# EAGLE design vu3 (EAGLE 6.2)
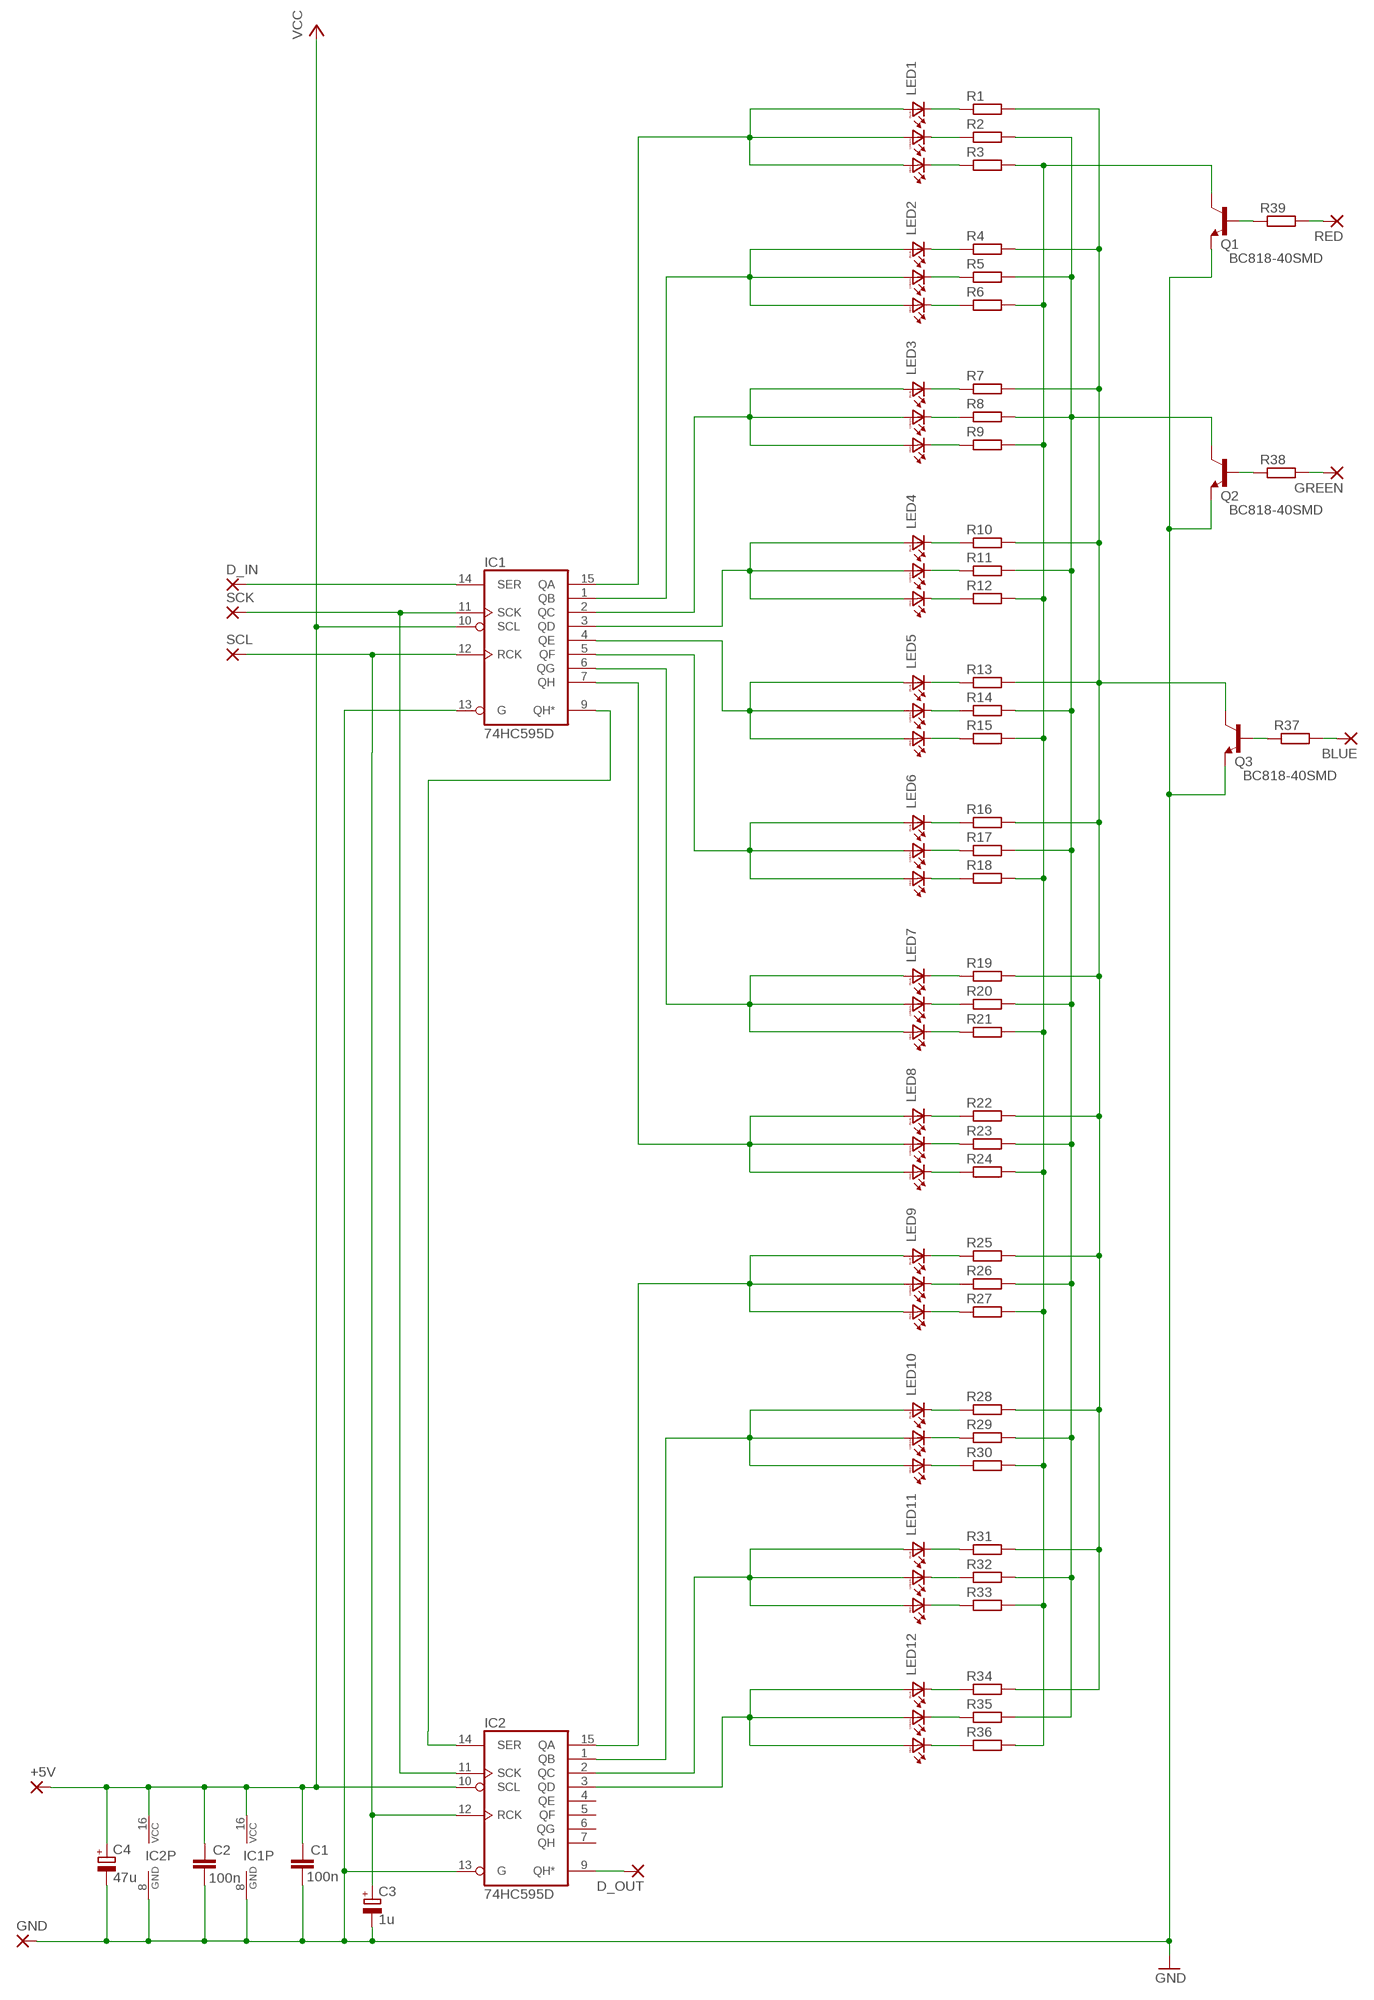
[diagram p0: schematic, sheet 1]

## Parts
+5V  2,54/0,8  [2,54/0,8]
BLUE  2,54/0,8  [2,54/0,8]
C1  100n  C-EUC1206  [C1206]
C2  100n  C-EUC1206  [C1206]
C3  1u  CPOL-EUE5-5-L-12SMD  [E5-5-L-12SMD]
C4  47u  CPOL-EUE2.5-5-L-12-SMD  [E2,5-5-L-12SMD]
D_IN  2,54/0,8  [2,54/0,8]
D_OUT  2,54/0,8  [2,54/0,8]
GND  2,54/0,8  [2,54/0,8]
GREEN  2,54/0,8  [2,54/0,8]
IC1  74HC595D  [SO16]
IC2  74HC595D  [SO16]
LED1  LED_RGB_PLCC6  [PLCC6]
LED2  LED_RGB_PLCC6  [PLCC6]
LED3  LED_RGB_PLCC6  [PLCC6]
LED4  LED_RGB_PLCC6  [PLCC6]
LED5  LED_RGB_PLCC6  [PLCC6]
LED6  LED_RGB_PLCC6  [PLCC6]
LED7  LED_RGB_PLCC6  [PLCC6]
LED8  LED_RGB_PLCC6  [PLCC6]
LED9  LED_RGB_PLCC6  [PLCC6]
LED10  LED_RGB_PLCC6  [PLCC6]
LED11  LED_RGB_PLCC6  [PLCC6]
LED12  LED_RGB_PLCC6  [PLCC6]
Q1  BC818-40SMD  [SOT23-BEC]
Q2  BC818-40SMD  [SOT23-BEC]
Q3  BC818-40SMD  [SOT23-BEC]
R1  R-EU_R1206  [R1206]
R2  R-EU_R1206  [R1206]
R3  R-EU_R1206  [R1206]
R4  R-EU_R1206  [R1206]
R5  R-EU_R1206  [R1206]
R6  R-EU_R1206  [R1206]
R7  R-EU_R1206  [R1206]
R8  R-EU_R1206  [R1206]
R9  R-EU_R1206  [R1206]
R10  R-EU_R1206  [R1206]
R11  R-EU_R1206  [R1206]
R12  R-EU_R1206  [R1206]
R13  R-EU_R1206  [R1206]
R14  R-EU_R1206  [R1206]
R15  R-EU_R1206  [R1206]
R16  R-EU_R1206  [R1206]
R17  R-EU_R1206  [R1206]
R18  R-EU_R1206  [R1206]
R19  R-EU_R1206  [R1206]
R20  R-EU_R1206  [R1206]
R21  R-EU_R1206  [R1206]
R22  R-EU_R1206  [R1206]
R23  R-EU_R1206  [R1206]
R24  R-EU_R1206  [R1206]
R25  R-EU_R1206  [R1206]
R26  R-EU_R1206  [R1206]
R27  R-EU_R1206  [R1206]
R28  R-EU_R1206  [R1206]
R29  R-EU_R1206  [R1206]
R30  R-EU_R1206  [R1206]
R31  R-EU_R1206  [R1206]
R32  R-EU_R1206  [R1206]
R33  R-EU_R1206  [R1206]
R34  R-EU_R1206  [R1206]
R35  R-EU_R1206  [R1206]
R36  R-EU_R1206  [R1206]
R37  R-EU_R1206  [R1206]
R38  R-EU_R1206  [R1206]
R39  R-EU_R1206  [R1206]
RED  2,54/0,8  [2,54/0,8]
SCK  2,54/0,8  [2,54/0,8]
SCL  2,54/0,8  [2,54/0,8]

## Nets
N$1: LED1.BC R1.1
N$2: R39.2 RED.1(P)
N$3: LED1.RC R3.1
N$5: LED2.GC R5.1
N$6: IC1.11(SCK) IC2.11(SCK) SCK.1(P)
N$7: LED3.BC R7.1
N$9: LED3.RC R9.1
N$10: +5V.1(P) C1.1 C2.1 C4.+ IC1.10(SCL) IC1.16(VCC) IC2.10(SCL) IC2.16(VCC) ; supply symbol labelled VCC
N$11: LED4.GC R11.1
N$12: IC2.15(QA) LED9.BA LED9.GA LED9.RA
N$13: LED5.BC R13.1
N$14: LED1.GC R2.1
N$15: LED5.RC R15.1
N$16: LED2.BC R4.1
N$17: LED6.GC R17.1
N$18: LED2.RC R6.1
N$19: LED7.BC R19.1
N$20: LED3.GC R8.1
N$21: LED7.RC R21.1
N$22: LED4.BC R10.1
N$23: LED8.GC R23.1
N$24: LED4.RC R12.1
N$25: LED9.BC R25.1
N$26: LED5.GC R14.1
N$27: LED9.RC R27.1
N$28: LED6.BC R16.1
N$29: LED10.GC R29.1
N$30: LED6.RC R18.1
N$31: LED11.BC R31.1
N$32: LED7.GC R20.1
N$33: LED11.RC R33.1
N$34: LED8.BC R22.1
N$35: LED12.GC R35.1
N$36: LED8.RC R24.1
N$38: LED9.GC R26.1
N$40: LED10.BC R28.1
N$42: LED10.RC R30.1
N$44: LED11.GC R32.1
N$45: LED12.BC R34.1
N$46: LED12.RC R36.1
N$51: GREEN.1(P) R38.2
N$52: IC1.9(QH*) IC2.14(SER)
N$53: Q3.B R37.1
N$54: BLUE.1(P) R37.2
N$55: Q2.B R38.1
N$58: IC1.1(QB) LED2.BA LED2.GA LED2.RA
N$59: IC1.2(QC) LED3.BA LED3.GA LED3.RA
N$60: IC1.3(QD) LED4.BA LED4.GA LED4.RA
N$61: IC1.4(QE) LED5.BA LED5.GA LED5.RA
N$62: IC1.5(QF) LED6.BA LED6.GA LED6.RA
N$63: IC1.6(QG) LED7.BA LED7.GA LED7.RA
N$64: C1.2 C2.2 C3.- C4.- GND.1(P) IC1.8(GND) IC1.13(G) IC2.8(GND) IC2.13(G) Q1.E Q2.E Q3.E ; supply symbol labelled GND
N$68: D_IN.1(P) IC1.14(SER)
N$69: IC1.7(QH) LED8.BA LED8.GA LED8.RA
N$71: Q1.B R39.1
N$72: Q3.C R1.2 R4.2 R7.2 R10.2 R13.2 R16.2 R19.2 R22.2 R25.2 R28.2 R31.2 R34.2
N$78: IC1.15(QA) LED1.BA LED1.GA LED1.RA
N$89: Q2.C R2.2 R5.2 R8.2 R11.2 R14.2 R17.2 R20.2 R23.2 R26.2 R29.2 R32.2 R35.2
N$90: C3.+ IC1.12(RCK) IC2.12(RCK) SCL.1(P)
N$92: D_OUT.1(P) IC2.9(QH*)
N$93: Q1.C R3.2 R6.2 R9.2 R12.2 R15.2 R18.2 R21.2 R24.2 R27.2 R30.2 R33.2 R36.2
N$94: IC2.1(QB) LED10.BA LED10.GA LED10.RA
N$95: IC2.2(QC) LED11.BA LED11.GA LED11.RA
N$96: IC2.3(QD) LED12.BA LED12.GA LED12.RA
Unconnected: IC2.4(QE) IC2.5(QF) IC2.6(QG) IC2.7(QH)

## Library data of the parts
+5V BLUE D_IN D_OUT GND GREEN RED SCK SCL = wirepad:2,54/0,8: THROUGH-HOLE PAD
C1 C2 = resistor:C-EU: CAPACITOR, European symbol
C3 C4 = elkos:CPOL-EU: POLARIZED CAPACITOR, European symbol
IC1 IC2 = 74xx:74*595: 8-bit SHIFT REGISTER, output latch
LED1-LED12 = led-rgb-plcc6:LED_RGB_PLCC6: Full color Z-Power LED RGB P5-II Series Source: http://www.seoulsemicon.co.kr .. F50360.pdf
Q1-Q3 = transistor-npn:BC818*: NPN Transistor
R1-R39 = resistor:R-EU_: RESISTOR, European symbol

## Board
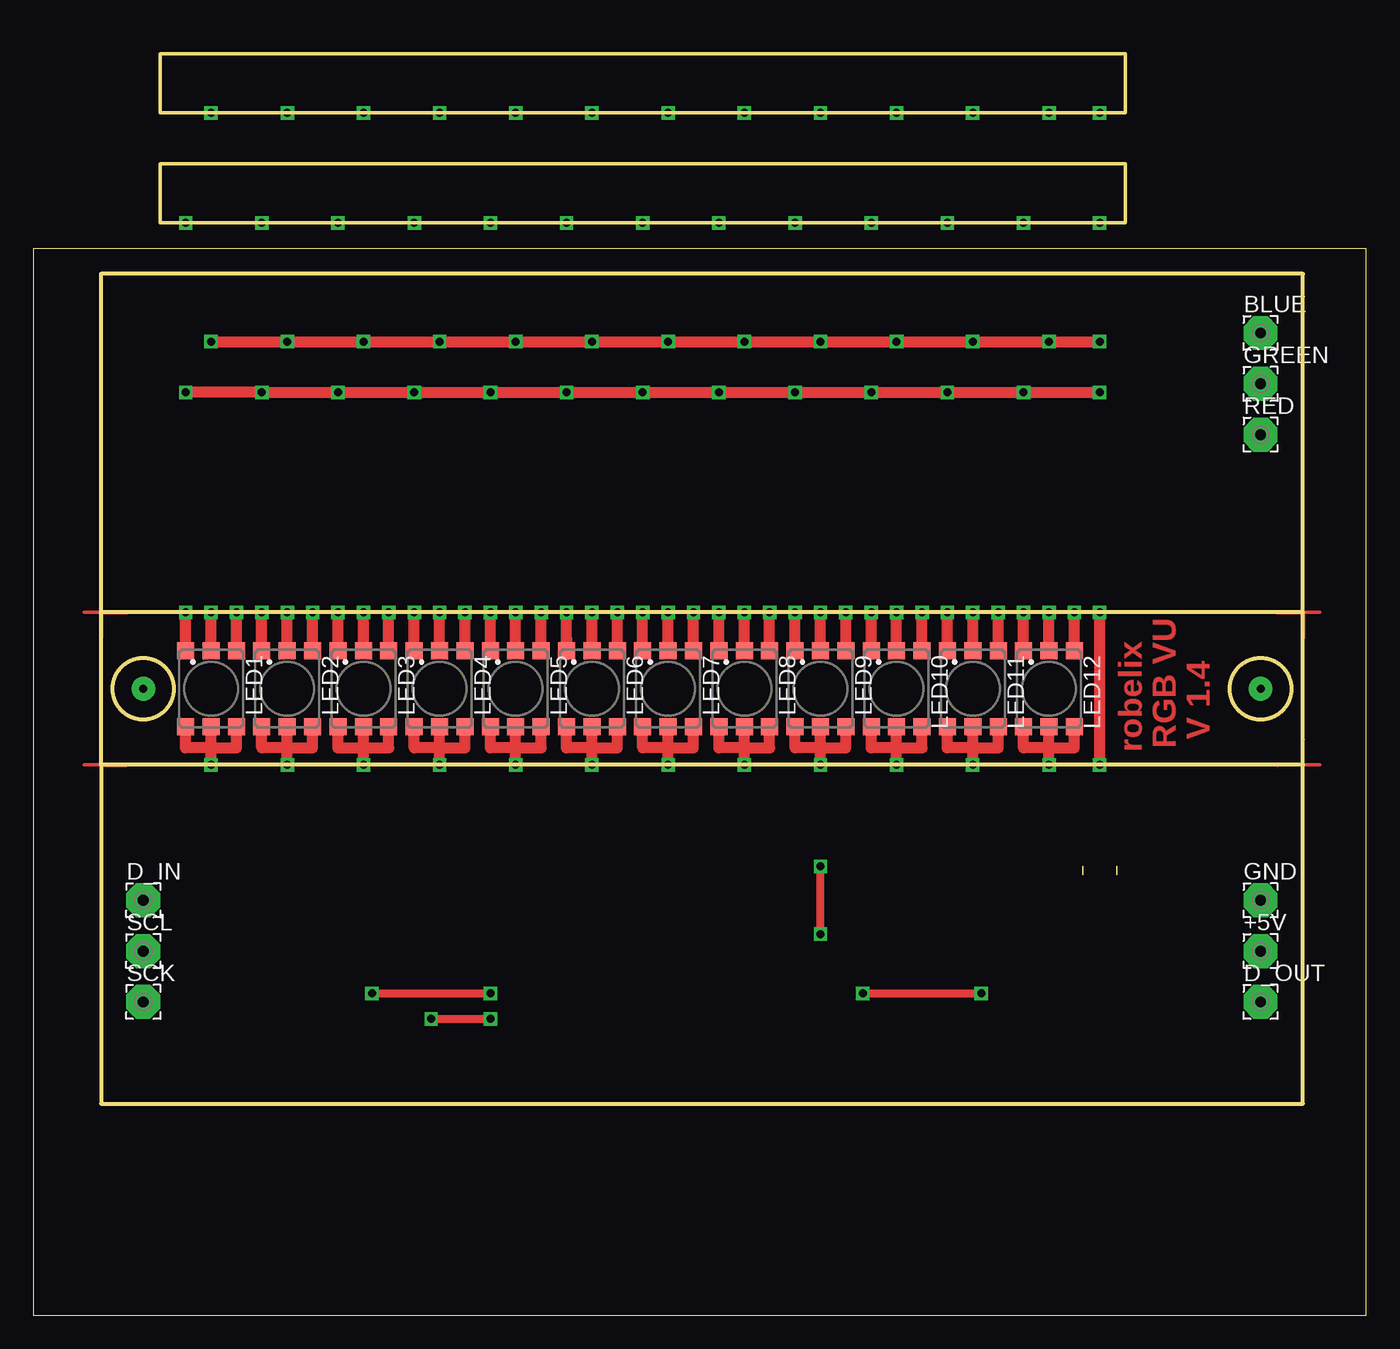
[diagram p1: board, top side]
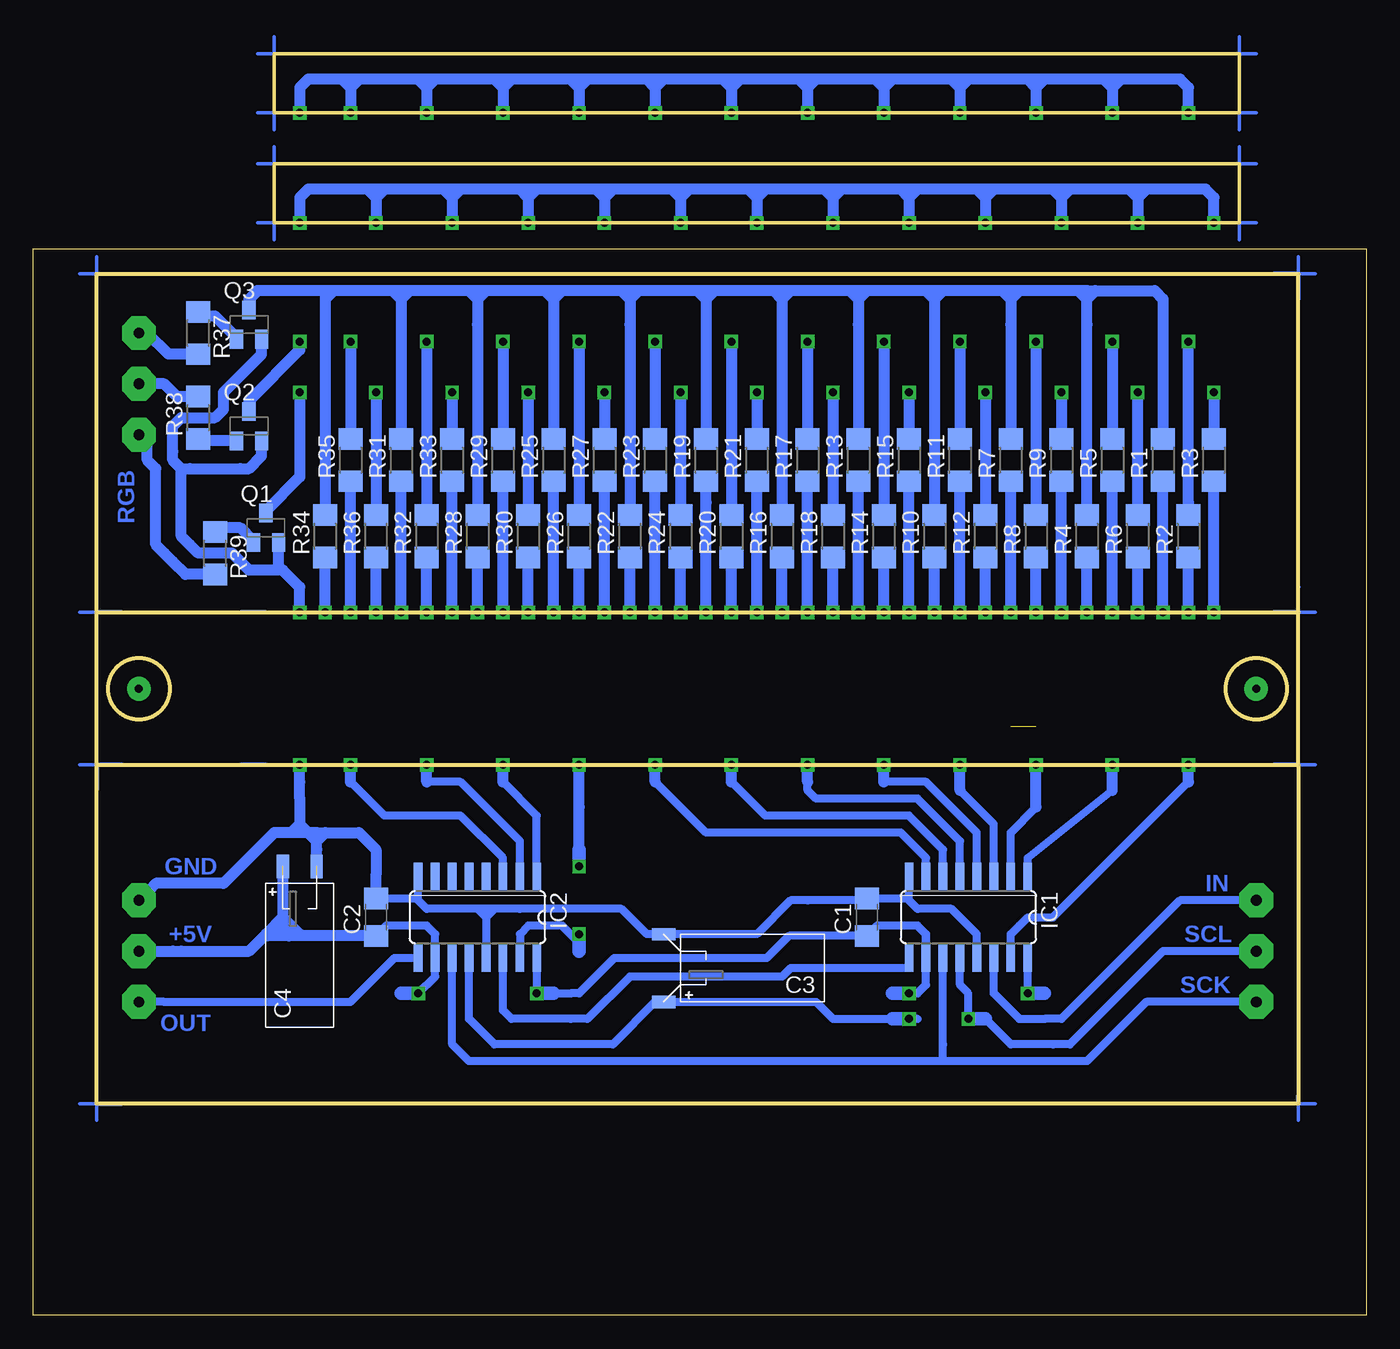
[diagram p2: board, bottom side, seen from below]

Size 100 x 94.61 mm. Coordinates in mm from the lower left corner, seen from the top.
Outline: 95.25,41.27 95.25,15.88 5.08,15.88 5.08,41.27
Outline: 95.25,41.27 95.25,52.7
Outline: 95.25,52.7 95.25,78.11 5.08,78.11 5.08,52.7
Outline: 95.25,41.27 5.08,41.27
Outline: 5.08,41.27 5.08,52.7
Outline: 95.25,52.7 5.08,52.7
Outline: 0,0 100,0 100,80 0,80 0,0
Outline: 9.53,86.36 9.53,81.92 81.92,81.92 81.92,86.36 9.53,86.36
Outline: 9.53,94.61 9.53,90.17 81.92,90.17 81.92,94.61 9.53,94.61
Outline: circle at 8.26,46.99 radius 2.29
Outline: circle at 92.08,46.99 radius 2.29
Copper layers (1*16): Top 0.035mm / dielectric 1.5mm / Bottom 0.035mm
Design rules "default": minimum track width 10mil, minimum drill 24mil, track to track 8mil, track to pad 8mil, pad to pad 8mil, via to via 8mil, smd to smd 8mil, copper to edge 40mil, drill to drill 8mil, minimum pad ring 10mil, minimum via ring 8mil, stop-mask expansion 4mil, vias tented up to drill 0mil, thermal gap 10mil

### Footprints (pad centres in the part's own frame; a part is rotated, then mirrored left to right if it is on the bottom)
2,54/0,8 = drill 0.813 pad 2.54 octagon: 1 0,0
C1206 = smd 1.6 x 1.8: 1 -1.4,0; 2 1.4,0
E5-5-L-12SMD = smd 0.914 x 1.778: + -2.54,0.635; - 2.54,0.635
E2,5-5-L-12SMD = smd 0.914 x 1.778: + -1.27,0.635; - 1.27,0.635
SO16 = smd 0.66 x 2.032: 1 -4.445,-3.073; 2 -3.175,-3.073; 3 -1.905,-3.073; 4 -0.635,-3.073; 5 0.635,-3.073; 6 1.905,-3.073; 7 3.175,-3.073; 8 4.445,-3.073; 9 4.445,3.073; 10 3.175,3.073; 11 1.905,3.073; 12 0.635,3.073; 13 -0.635,3.073; 14 -1.905,3.073; 15 -3.175,3.073; 16 -4.445,3.073
PLCC6 = smd 1.27 x 1.27: BA 2.857,1.905; BC -2.857,1.905; GA 2.857,0; GC -2.857,0; RA 2.857,-1.905; RC -2.857,-1.905
SOT23-BEC = smd 1 x 1.4: B -0.95,-1.1; C 0,1.1; E 0.95,-1.1
R1206 = smd 1.6 x 1.803: 1 -1.587,0; 2 1.587,0

### Placement (x,y rotation side)
+5V  92.08,27.3 0 top
BLUE  92.08,73.66 0 top
C1  37.47,29.84 90 bottom
C2  74.3,29.84 90 bottom
C3  52.07,26.04 90 bottom
C4  80.01,33.02 0 bottom
D_IN  8.26,31.11 0 top
D_OUT  92.08,23.5 0 top
GND  92.08,31.11 0 top
GREEN  92.08,69.85 0 top
IC1  29.84,29.84 180 bottom
IC2  66.67,29.84 180 bottom
LED1  13.34,46.99 270 top
LED2  19.05,46.99 270 top
LED3  24.77,46.99 270 top
LED4  30.48,46.99 270 top
LED5  36.2,46.99 270 top
LED6  41.91,46.99 270 top
LED7  47.62,46.99 270 top
LED8  53.34,46.99 270 top
LED9  59.05,46.99 270 top
LED10  64.77,46.99 270 top
LED11  70.48,46.99 270 top
LED12  76.2,46.99 270 top
Q1  82.55,59.05 0 bottom
Q2  83.82,66.67 0 bottom
Q3  83.82,74.3 0 bottom
R1  15.24,64.14 90 bottom
R2  13.34,58.42 90 bottom
R3  11.43,64.14 90 bottom
R4  20.95,58.42 90 bottom
R5  19.05,64.14 90 bottom
R6  17.14,58.42 90 bottom
R7  26.67,64.14 90 bottom
R8  24.77,58.42 90 bottom
R9  22.86,64.14 90 bottom
R10  32.38,58.42 90 bottom
R11  30.48,64.14 90 bottom
R12  28.57,58.42 90 bottom
R13  38.1,64.14 90 bottom
R14  36.2,58.42 90 bottom
R15  34.29,64.14 90 bottom
R16  43.81,58.42 90 bottom
R17  41.91,64.14 90 bottom
R18  40.01,58.42 90 bottom
R19  49.53,64.14 90 bottom
R20  47.62,58.42 90 bottom
R21  45.72,64.14 90 bottom
R22  55.24,58.42 90 bottom
R23  53.34,64.14 90 bottom
R24  51.44,58.42 90 bottom
R25  60.96,64.14 90 bottom
R26  59.05,58.42 90 bottom
R27  57.15,64.14 90 bottom
R28  66.67,58.42 90 bottom
R29  64.77,64.14 90 bottom
R30  62.87,58.42 90 bottom
R31  72.39,64.14 90 bottom
R32  70.48,58.42 90 bottom
R33  68.58,64.14 90 bottom
R34  78.11,58.42 90 bottom
R35  76.2,64.14 90 bottom
R36  74.3,58.42 90 bottom
R37  87.63,73.66 270 bottom
R38  87.63,67.31 90 bottom
R39  86.36,57.15 270 bottom
RED  92.08,66.04 0 top
SCK  8.26,23.5 0 top
SCL  8.26,27.3 0 top

### Tracks (layer width: path | path; a pad name or v marks a point on that pad's centre or on a via)
N$1  (via drill 0.6 pad 0.25)
  Top 0.813: LED1.BC v15.24,52.7
  Bottom 0.813: v15.24,52.7 R1.1
N$2
  Bottom 0.813: R39.2 88.58,55.56 89.53,56.52 90.17,57.15 90.81,57.78 90.81,63.5 91.44,64.14 91.44,65.41 RED.1
N$3  (via drill 0.6 pad 0.25)
  Top 0.813: LED1.RC v11.43,52.7
  Bottom 0.813: v11.43,52.7 R3.1
N$4  (via drill 0.6 pad 1.78)
  other vias: 92.08,46.99
N$5  (via drill 0.6 pad 0.25)
  Top 0.813: LED2.GC v19.05,52.7
  Bottom 0.813: v19.05,52.7 R5.1
N$6
  Bottom 0.61: SCK.1 16.51,23.5 20.95,19.05 22.23,19.05 30.48,19.05 31.75,19.05 | IC1.11 31.75,20.32 31.75,19.05 | 31.75,19.05 50.16,19.05 67.31,19.05 68.58,20.32 IC2.11
N$7  (via drill 0.6 pad 0.25)
  Top 0.813: LED3.BC v26.67,52.7
  Bottom 0.813: v26.67,52.7 R7.1
N$8  (via drill 0.6 pad 1.78)
  other vias: 8.26,46.99
N$9  (via drill 0.6 pad 0.25)
  Top 0.813: LED3.RC v22.86,52.7
  Bottom 0.813: v22.86,52.7 R9.1
N$10  (via drill 0.6)
  Top 0.61: v25.4,24.13 v34.29,24.13 | v62.23,24.13 v71.12,24.13
  Bottom 0.61: v34.29,24.13 33.66,24.13 33.02,24.77 33.02,28.57 | 33.02,28.57 IC1.10 33.02,28.57 | 33.02,28.57 33.66,29.21 36.7,29.21 C1.1 43.31,28.45 43.81,27.94 44.98,26.77 53.87,26.77 56.41,26.77 59.05,24.13 59.69,24.13 60.96,24.13 | 25.4,25.4 v25.4,24.13 25.4,25.4 | 25.4,25.4 IC1.16 | 25.4,25.4 IC1.16 | 25.4,25.4 IC1.16 | IC2.16 62.23,26.04 62.23,25.4 62.23,24.77 v62.23,24.13 | v71.12,24.13 69.85,25.4 IC2.10 69.85,28.57 70.48,29.21 73.53,29.21 C2.1
  Bottom 0.813: 91.44,27.3 +5V.1 89.53,27.3 88.9,27.3 83.82,27.3 82.55,28.57 | C2.1 80.84,28.45 82.42,28.45 82.55,28.57 | C4.+ 81.28,29.84 | 81.28,29.84 82.55,28.57 | 81.28,29.84 80.01,28.57 80.64,28.57 81.28,29.21 81.92,28.57
  Bottom 1.016: v71.12,24.13 72.39,24.13 | v62.23,24.13 60.96,24.13 | v34.29,24.13 35.56,24.13 | v25.4,24.13 24.13,24.13
N$11  (via drill 0.6 pad 0.25)
  Top 0.813: LED4.GC v30.48,52.7
  Bottom 0.813: v30.48,52.7 R11.1
N$12  (via drill 0.6)
  Top 0.61: v59.05,28.57 v59.05,33.66
  Top 0.813: LED9.RA 57.15,42.55 59.05,42.55 | 59.05,42.55 60.96,42.55 LED9.BA | 59.05,42.55 LED9.GA | v59.05,41.27 59.05,42.55
  Bottom 0.61: IC2.15 63.5,28.57 62.87,29.21 60.33,29.21 59.69,28.57 | v59.05,28.57 59.69,28.57 | 59.69,28.57 59.05,27.94
  Bottom 0.813: v59.05,41.27 59.05,38.1 59.05,34.92 v59.05,33.66
  Bottom 1.016: v59.05,33.66 59.05,34.92 | v59.05,28.57 59.05,27.94 59.05,27.3
N$13  (via drill 0.6 pad 0.25)
  Top 0.813: LED5.BC v38.1,52.7
  Bottom 0.813: v38.1,52.7 R13.1
N$14  (via drill 0.6)
  Top 0.813: LED1.GC v13.34,52.7
  Bottom 0.813: v13.34,52.7 R2.1
N$15  (via drill 0.6 pad 0.25)
  Top 0.813: LED5.RC v34.29,52.7
  Bottom 0.813: v34.29,52.7 R15.1
N$16  (via drill 0.6)
  Top 0.813: LED2.BC v20.95,52.7
  Bottom 0.813: v20.95,52.7 20.95,56.52 R4.1
N$17  (via drill 0.6 pad 0.25)
  Top 0.813: LED6.GC v41.91,52.7
  Bottom 0.813: v41.91,52.7 R17.1
N$18  (via drill 0.6)
  Top 0.813: LED2.RC v17.14,52.7
  Bottom 0.813: v17.14,52.7 R6.1
N$19  (via drill 0.6 pad 0.25)
  Top 0.813: LED7.BC v49.53,52.7
  Bottom 0.813: v49.53,52.7 49.53,60.96 R19.1
N$20  (via drill 0.6)
  Top 0.813: LED3.GC v24.77,52.7
  Bottom 0.813: v24.77,52.7 R8.1
N$21  (via drill 0.6 pad 0.25)
  Top 0.813: LED7.RC v45.72,52.7
  Bottom 0.813: v45.72,52.7 R21.1
N$22  (via drill 0.6)
  Top 0.813: LED4.BC v32.38,52.7
  Bottom 0.813: v32.38,52.7 R10.1
N$23  (via drill 0.6 pad 0.25)
  Top 0.813: LED8.GC v53.34,52.7
  Bottom 0.813: v53.34,52.7 R23.1
N$24  (via drill 0.6)
  Top 0.813: LED4.RC v28.57,52.7
  Bottom 0.813: v28.57,52.7 R12.1
N$25  (via drill 0.6 pad 0.25)
  Top 0.813: LED9.BC v60.96,52.7
  Bottom 0.813: v60.96,52.7 R25.1
N$26  (via drill 0.6)
  Top 0.813: LED5.GC v36.2,52.7
  Bottom 0.813: v36.2,52.7 R14.1
N$27  (via drill 0.6 pad 0.25)
  Top 0.813: LED9.RC v57.15,52.7
  Bottom 0.813: v57.15,52.7 R27.1
N$28  (via drill 0.6)
  Top 0.813: LED6.BC v43.81,52.7
  Bottom 0.813: v43.81,52.7 R16.1
N$29  (via drill 0.6 pad 0.25)
  Top 0.813: LED10.GC v64.77,52.7
  Bottom 0.813: v64.77,52.7 R29.1
N$30  (via drill 0.6)
  Top 0.813: 40.01,50.8 40.01,50.16 | 40.01,50.8 v40.01,52.7 | LED6.RC 40.01,49.53 | LED6.RC 40.01,50.8 | LED6.RC 40.01,50.8
  Bottom 0.813: v40.01,52.7 40.01,56.2 | 40.01,56.2 40.01,56.52 | 40.01,56.2 R18.1
N$31  (via drill 0.6 pad 0.25)
  Top 0.813: LED11.BC v72.39,52.7
  Bottom 0.813: v72.39,52.7 R31.1
N$32  (via drill 0.6)
  Top 0.813: LED7.GC v47.62,52.7
  Bottom 0.813: v47.62,52.7 R20.1
N$33  (via drill 0.6 pad 0.25)
  Top 0.813: LED11.RC v68.58,52.7
  Bottom 0.813: v68.58,52.7 R33.1
N$34  (via drill 0.6)
  Top 0.813: LED8.BC v55.24,52.7
  Bottom 0.813: v55.24,52.7 R22.1
N$35  (via drill 0.6 pad 0.25)
  Top 0.813: LED12.GC v76.2,52.7
  Bottom 0.813: v76.2,52.7 R35.1
N$36  (via drill 0.6)
  Top 0.813: LED8.RC v51.44,52.7
  Bottom 0.813: v51.44,52.7 R24.1
N$37
  Top 0.254: 3.81,52.7 5.08,52.7 5.08,53.98
  Top 0.305: 5.08,50.8 5.08,52.7 6.99,52.7
N$38  (via drill 0.6)
  Top 0.813: LED9.GC v59.05,52.7
  Bottom 0.813: v59.05,52.7 R26.1
N$39
  Top 0.254: 5.08,40.01 5.08,41.27 3.81,41.27
  Top 0.305: 6.99,41.27 5.08,41.27 5.08,43.18
N$40  (via drill 0.6)
  Top 0.813: LED10.BC v66.67,52.7
  Bottom 0.813: v66.67,52.7 R28.1
N$41
  Top 0.254: 96.52,41.27 95.25,41.27 95.25,40.01
  Top 0.305: 93.34,41.27 95.25,41.27 95.25,43.18
N$42  (via drill 0.6)
  Top 0.813: LED10.RC v62.87,52.7
  Bottom 0.813: v62.87,52.7 R30.1
N$43
  Top 0.254: 96.52,52.7 95.25,52.7 95.25,53.98
  Top 0.305: 93.34,52.7 95.25,52.7 95.25,50.8
N$44  (via drill 0.6)
  Top 0.813: LED11.GC v70.48,52.7
  Bottom 0.813: v70.48,52.7 R32.1
N$45  (via drill 0.6)
  Top 0.813: LED12.BC v78.11,52.7
  Bottom 0.813: v78.11,52.7 R34.1
N$46  (via drill 0.6)
  Top 0.813: LED12.RC v74.3,52.7
  Bottom 0.813: v74.3,52.7 R36.1
N$47  (via drill 0.6)
  Bottom 0.813: v11.43,81.92 11.43,83.82 12.06,84.45 16.51,84.45 | 16.51,84.45 17.14,84.45 | 17.14,84.45 17.14,83.82 | 17.14,83.82 v17.14,81.92 | 17.14,84.45 17.78,84.45 | 17.78,84.45 22.23,84.45 | 22.23,84.45 22.86,84.45 | 22.86,84.45 22.86,83.82 | 22.86,83.82 v22.86,81.92 | 22.86,84.45 23.5,84.45 | 23.5,84.45 27.94,84.45 | 27.94,84.45 28.57,84.45 | 28.57,84.45 28.57,83.82 | 28.57,83.82 v28.57,81.92 | 28.57,84.45 29.21,84.45 | 29.21,84.45 33.66,84.45 | 33.66,84.45 34.29,84.45 | 34.29,84.45 34.29,83.82 | 34.29,83.82 v34.29,81.92 | 34.29,84.45 34.92,84.45 | 34.92,84.45 39.37,84.45 | 39.37,84.45 40.01,84.45 | 40.01,84.45 40.01,83.82 | 40.01,83.82 v40.01,81.92 | 40.01,84.45 40.64,84.45 | 40.64,84.45 45.09,84.45 | 45.09,84.45 45.72,84.45 | 45.72,84.45 45.72,83.82 | 45.72,83.82 v45.72,81.92 | 45.72,84.45 46.35,84.45 | 46.35,84.45 50.8,84.45 | 50.8,84.45 51.44,84.45 | 51.44,84.45 51.44,83.82 | 51.44,83.82 v51.44,81.92 | 51.44,84.45 52.07,84.45 | 52.07,84.45 56.52,84.45 | 56.52,84.45 57.15,84.45 | 57.15,84.45 57.15,83.82 | 57.15,83.82 v57.15,81.92 | 57.15,84.45 57.78,84.45 | 57.78,84.45 62.23,84.45 | 62.23,84.45 62.87,84.45 | 62.87,84.45 62.87,83.82 | 62.87,83.82 v62.87,81.92 | 62.87,84.45 63.5,84.45 | 63.5,84.45 67.94,84.45 | 67.94,84.45 68.58,84.45 | 68.58,84.45 68.58,83.82 | 68.58,83.82 v68.58,81.92 | 68.58,84.45 69.22,84.45 | 69.22,84.45 73.66,84.45 | 73.66,84.45 74.3,84.45 | 74.3,84.45 74.3,83.82 | 74.3,83.82 v74.3,81.92 | v80.01,81.92 80.01,83.82 79.38,84.45 74.93,84.45 | 74.3,84.45 74.93,84.45 | 74.3,83.82 74.93,84.45 | 73.66,84.45 74.3,83.82 | 68.58,83.82 69.22,84.45 | 67.94,84.45 68.58,83.82 | 62.87,83.82 63.5,84.45 | 62.23,84.45 62.87,83.82 | 57.15,83.82 57.78,84.45 | 56.52,84.45 57.15,83.82
  Bottom 0.813: 51.44,83.82 52.07,84.45 | 50.8,84.45 51.44,83.82 | 45.72,83.82 46.35,84.45 | 45.09,84.45 45.72,83.82 | 40.01,83.82 40.64,84.45 | 39.37,84.45 40.01,83.82 | 34.29,83.82 34.92,84.45 | 33.66,84.45 34.29,83.82 | 28.57,83.82 29.21,84.45 | 27.94,84.45 28.57,83.82 | 22.86,83.82 23.5,84.45 | 22.23,84.45 22.86,83.82 | 17.14,83.82 17.78,84.45 | 16.51,84.45 17.14,83.82
N$48
  Bottom 0.305: 82.55,52.7 84.45,52.7
N$49
  Bottom 0.254: 95.25,51.44 95.25,52.7 96.52,52.7
  Bottom 0.305: 95.25,52.7 93.34,52.7 95.25,52.7 | 95.25,52.7 95.25,54.61
N$50
  Bottom 0.254: 95.25,42.55 95.25,41.27 96.52,41.27
  Bottom 0.305: 95.25,41.27 93.34,41.27 95.25,41.27 | 95.25,41.27 95.25,39.37
N$51
  Bottom 0.813: R38.2 89.22,68.9 90.17,69.85 GREEN.1
N$52
  Bottom 0.61: IC1.9 34.29,26.04 43.18,26.04 43.81,25.4 52.07,25.4 52.7,25.4 55.24,25.4 58.42,22.23 59.69,22.23 64.14,22.23 64.77,22.86 IC2.14
N$53
  Bottom 0.813: Q3.B 84.77,73.34 86.36,74.93 87.31,74.93 R37.1
N$54
  Bottom 0.813: R37.2 89.85,72.07 91.44,73.66 BLUE.1
N$55
  Bottom 0.813: Q2.B 87.48,65.58 R38.1
N$56
  Bottom 0.305: 82.55,41.27 84.45,41.27
N$57
  Bottom 0.254: 96.52,15.88 95.25,15.88 95.25,14.61
  Bottom 0.305: 95.25,16.51 95.25,15.88 93.34,15.88
N$58  (via drill 0.6 pad 0.25)
  Top 0.813: v19.05,41.27 19.05,42.55 | 19.05,42.55 LED2.GA | LED2.RA 17.14,42.55 19.05,42.55 | 19.05,42.55 20.95,42.55 LED2.BA
  Bottom 0.61: IC1.1 25.4,34.29 19.05,39.37 v19.05,41.27
  Bottom 0.813: 19.05,39.37 v19.05,41.27
N$59  (via drill 0.6)  (1 unrouted)
  Top 0.813: LED3.RA 22.86,42.55 26.67,42.55 LED3.BA | v24.77,41.27 LED3.GA
  Bottom 0.61: IC1.2 26.67,36.2 24.77,38.1 v24.77,41.27
  Bottom 0.813: 24.77,38.1 v24.77,41.27
N$60  (via drill 0.6 pad 0.25)
  Top 0.813: LED4.RA 28.57,42.55 30.48,42.55 | 30.48,42.55 32.38,42.55 LED4.BA | 30.48,42.55 LED4.GA | v30.48,41.27 30.48,42.55
  Bottom 0.61: IC1.3 27.94,36.83 30.48,39.37 v30.48,41.27
  Bottom 0.813: 30.48,39.37 v30.48,41.27
N$61  (via drill 0.6)
  Top 0.813: LED5.RA 34.29,42.55 36.2,42.55 | 36.2,42.55 38.1,42.55 LED5.BA | 36.2,42.55 LED5.GA | v36.2,41.27 36.2,42.55
  Bottom 0.61: IC1.4 29.21,36.2 33.02,40.01 36.2,40.01
  Bottom 0.813: 36.2,40.01 v36.2,41.27
N$62  (via drill 0.6 pad 0.25)
  Top 0.813: LED6.RA 40.01,42.55 41.91,42.55 | 41.91,42.55 43.81,42.55 LED6.BA | 41.91,42.55 LED6.GA | v41.91,41.27 41.91,42.55
  Bottom 0.61: IC1.5 30.48,35.56 33.66,38.73 40.64,38.73 41.27,38.73 41.91,39.37 41.91,40.01
  Bottom 0.813: 41.91,40.01 v41.91,41.27
N$63  (via drill 0.6)
  Top 0.813: LED7.RA 45.72,42.55 47.62,42.55 | 47.62,42.55 49.53,42.55 LED7.BA | 47.62,42.55 LED7.GA | v47.62,41.27 47.62,42.55
  Bottom 0.61: IC1.6 31.75,34.92 34.29,37.47 43.81,37.47 45.09,37.47 47.62,40.01
  Bottom 0.813: 47.62,40.01 v47.62,41.27
N$64  (via drill 0.6 pad 0.25)
  Top 0.813: v80.01,41.27 v80.01,52.7
  Bottom 0.61: IC1.13 29.21,28.57 31.11,30.48 33.66,30.48 34.29,31.11 | 34.29,31.11 IC1.8 | 65.41,30.48 63.5,30.48 55.88,30.48 53.98,28.57 C3.- 45.72,28.57 43.18,31.11 41.91,31.11 37.59,31.11 C1.2 34.42,31.25 34.29,31.11 | 65.41,30.48 66.04,30.48 | 66.04,30.48 66.67,30.48 | 66.67,30.48 70.48,30.48 71.12,31.11 | 66.04,30.48 66.04,29.84 | 66.04,29.84 IC2.13 | 71.12,31.11 IC2.8 | C2.2 71.25,31.25 71.12,31.11 | 65.41,30.48 66.04,29.84 | 66.04,29.84 66.67,30.48
  Bottom 0.813: v80.01,52.7 80.01,54.61 81.28,55.88 | v80.01,41.27 80.01,40.01 80.01,38.73 80.01,37.47 80.01,36.83 | GND.1 91.31,31.88 90.81,32.38 85.72,32.38 81.92,36.2 81.28,36.2 80.64,36.2 | 78.74,36.2 79.38,36.2 | 79.38,36.2 80.01,36.2 | 80.01,36.2 80.64,36.2 | C2.2 74.3,31.11 C2.2 | C2.2 74.3,33.02 74.3,34.92 75.56,36.2 78.11,36.2 | Q3.E 82.87,72.07 83.82,71.12 85.72,69.22 85.72,67.94 86.36,67.31 88.9,67.31 89.53,66.67 89.53,64.77 89.53,64.14 88.9,63.5 | 88.27,63.5 84.45,63.5 83.82,63.5 | Q2.E 82.87,64.45 83.82,63.5 | 88.27,63.5 83.82,63.5 | 87.63,57.15 88.27,57.78 | 87.63,57.15 85.09,57.15 83.82,55.88 81.28,55.88 | Q1.E 81.6,56.2 81.28,55.88 | 88.9,63.5 88.27,63.5 | 88.9,63.5 88.9,58.42 87.63,57.15 | C4.- 78.74,34.92 | 78.74,34.92 78.74,36.2 | 78.74,36.2 78.11,36.2 | 78.74,34.92 78.74,35.56 | 78.74,35.56 78.11,36.2 | 78.74,34.92 78.74,35.56 | 78.74,35.56 79.38,36.2 | 80.01,36.83 80.01,36.2 | 80.01,36.83 79.38,36.2 | 80.01,36.83 80.64,36.2
N$67
  Bottom 0.254: 5.08,14.61 5.08,15.88 3.81,15.88
  Bottom 0.305: 6.99,15.88 5.08,15.88 5.08,16.51
N$68
  Bottom 0.61: D_IN.1 13.97,31.11 22.86,22.23 24.13,22.23 26.04,22.23 27.94,24.13 IC1.14
N$69  (via drill 0.6 pad 0.25)
  Top 0.813: LED8.RA 51.44,42.55 53.34,42.55 | 53.34,42.55 55.24,42.55 LED8.BA | 53.34,42.55 LED8.GA | v53.34,41.27 53.34,42.55
  Bottom 0.61: IC1.7 33.02,34.29 34.92,36.2 48.26,36.2 49.53,36.2 53.34,40.01
  Bottom 0.813: 53.34,40.01 v53.34,41.27
N$70
  Bottom 0.254: 3.81,41.27 5.08,41.27 5.08,42.55
  Bottom 0.305: 5.08,39.37 5.08,41.27 6.99,41.27
N$71
  Bottom 0.813: Q1.B 83.5,58.1 84.45,59.05 86.04,59.05 R39.1
N$72
  Bottom 0.813: R1.2 15.24,74.3 15.24,76.2 15.88,76.83 20.32,76.83 | 20.95,76.83 20.32,76.83 | 20.95,76.83 21.59,76.83 | 21.59,76.83 26.04,76.83 | 26.04,76.83 26.67,76.83 | 26.67,76.83 27.3,76.83 | 27.3,76.83 31.75,76.83 | 31.75,76.83 32.38,76.83 | 32.38,76.83 33.02,76.83 | 33.02,76.83 37.47,76.83 | 37.47,76.83 38.1,76.83 | 38.1,76.83 38.73,76.83 | 38.73,76.83 43.18,76.83 | 43.18,76.83 43.81,76.83 | 43.81,76.83 44.45,76.83 | 44.45,76.83 46.99,76.83 48.9,76.83 | 20.95,76.2 20.95,74.3 R4.2 | 20.95,76.2 20.95,76.83 | 26.67,76.83 26.67,76.2 | 26.67,76.2 26.67,74.3 R7.2 | 32.38,76.83 32.38,76.2 | 32.38,76.2 32.38,74.3 R10.2 | 38.1,76.83 38.1,76.2 | 38.1,76.2 38.1,74.3 R13.2 | 43.81,76.83 43.81,76.2 | 43.81,76.2 43.81,74.3 R16.2 | 49.53,76.83 49.53,76.2 | 49.53,76.2 49.53,74.3 R19.2 | 55.24,76.83 55.24,76.2 | 55.24,76.2 55.24,74.3 R22.2 | 48.9,76.83 49.53,76.83 | 49.53,76.83 50.16,76.83 | 50.16,76.83 54.61,76.83 | 54.61,76.83 55.24,76.83 | 55.24,76.83 55.88,76.83 | 55.88,76.83 60.33,76.83 | 60.33,76.83 60.96,76.83 | 60.96,76.83 60.96,76.2 | 60.96,76.2 60.96,74.3 R25.2 | 60.96,76.83 61.59,76.83 | 61.59,76.83 66.04,76.83 | 66.04,76.83 66.67,76.83 | 66.67,76.83 66.67,76.2 | 66.67,76.2 66.67,74.3 R28.2 | 66.67,76.83 67.31,76.83 | 67.31,76.83 71.75,76.83 | 71.75,76.83 72.39,76.83 | 72.39,76.83 72.39,76.2 | 72.39,76.2 72.39,74.3 R31.2 | 72.39,76.83 73.03,76.83 | 73.03,76.83 77.47,76.83 | 77.47,76.83 78.11,76.83 | 78.11,76.83 78.11,76.2 | 78.11,76.2 78.11,74.3 R34.2 | 78.11,76.83 78.74,76.83 79.38,76.83 83.19,76.83 83.82,76.2 Q3.C | 20.95,76.2 20.32,76.83 | 20.95,76.2 21.59,76.83 | 26.04,76.83 26.67,76.2 | 26.67,76.2 27.3,76.83 | 31.75,76.83 32.38,76.2 | 32.38,76.2 33.02,76.83 | 37.47,76.83 38.1,76.2
  Bottom 0.813: 38.1,76.2 38.73,76.83 | 43.18,76.83 43.81,76.2 | 43.81,76.2 44.45,76.83 | 49.53,76.2 50.16,76.83 | 48.9,76.83 49.53,76.2 | 54.61,76.83 55.24,76.2 | 55.24,76.2 55.88,76.83 | 60.33,76.83 60.96,76.2 | 60.96,76.2 61.59,76.83 | 66.04,76.83 66.67,76.2 | 66.67,76.2 67.31,76.83 | 71.75,76.83 72.39,76.2 | 72.39,76.2 73.03,76.83 | 77.47,76.83 78.11,76.2
N$73
  Bottom 0.254: 5.08,51.44 5.08,52.7 3.81,52.7
  Bottom 0.305: 6.99,52.7 5.08,52.7 5.08,54.61
N$74
  Bottom 0.254: 3.81,78.11 5.08,78.11 5.08,79.38
  Bottom 0.305: 5.08,76.2 5.08,78.11 6.99,78.11
N$75
  Bottom 0.254: 96.52,78.11 95.25,78.11 95.25,79.38
  Bottom 0.305: 93.34,78.11 95.25,78.11 95.25,71.75
N$76  (via drill 0.6)
  Bottom 0.813: v13.34,90.17 13.34,92.08 13.97,92.71 18.41,92.71 | 18.41,92.71 19.05,92.71 | 19.05,92.71 19.05,92.08 | 19.05,92.08 v19.05,90.17 | 19.05,92.71 19.68,92.71 | 19.68,92.71 24.13,92.71 | 24.13,92.71 24.77,92.71 | 24.77,92.71 24.77,92.08 | 24.77,92.08 v24.77,90.17 | 24.77,92.71 25.4,92.71 | 25.4,92.71 29.84,92.71 | 29.84,92.71 30.48,92.71 | 30.48,92.71 30.48,92.08 | 30.48,92.08 v30.48,90.17 | 30.48,92.71 31.11,92.71 | 31.11,92.71 35.56,92.71 | 35.56,92.71 36.2,92.71 | 36.2,92.71 36.2,92.08 | 36.2,92.08 v36.2,90.17 | 36.2,92.71 36.83,92.71 | 36.83,92.71 41.27,92.71 | 41.27,92.71 41.91,92.71 | 41.91,92.71 41.91,92.08 | 41.91,92.08 v41.91,90.17 | 41.91,92.71 42.55,92.71 | 42.55,92.71 46.99,92.71 | 46.99,92.71 47.62,92.71 | 47.62,92.71 47.62,92.08 | 47.62,92.08 v47.62,90.17 | 47.62,92.71 48.26,92.71 | 48.26,92.71 52.7,92.71 | 52.7,92.71 53.34,92.71 | 53.34,92.71 53.34,92.08 | 53.34,92.08 v53.34,90.17 | 53.34,92.71 53.98,92.71 | 53.98,92.71 58.42,92.71 | 58.42,92.71 59.05,92.71 | 59.05,92.71 59.05,92.08 | 59.05,92.08 v59.05,90.17 | 59.05,92.71 59.69,92.71 | 59.69,92.71 64.14,92.71 | 64.14,92.71 64.77,92.71 | 64.77,92.71 64.77,92.08 | 64.77,92.08 v64.77,90.17 | 64.77,92.71 65.41,92.71 | 65.41,92.71 69.85,92.71 | 69.85,92.71 70.48,92.71 | 70.48,92.71 70.48,92.08 | 70.48,92.08 v70.48,90.17 | 70.48,92.71 71.12,92.71 | 71.12,92.71 75.56,92.71 | 75.56,92.71 76.2,92.71 | 76.2,92.71 76.2,92.08 | 76.2,92.08 v76.2,90.17 | 76.2,92.71 76.83,92.71 | 76.83,92.71 79.38,92.71 80.01,92.08 v80.01,90.17 | 76.2,92.08 76.83,92.71 | 75.56,92.71 76.2,92.08 | 70.48,92.08 71.12,92.71 | 69.85,92.71 70.48,92.08 | 64.77,92.08 65.41,92.71 | 64.14,92.71 64.77,92.08 | 59.05,92.08 59.69,92.71 | 58.42,92.71 59.05,92.08
  Bottom 0.813: 53.34,92.08 53.98,92.71 | 52.7,92.71 53.34,92.08 | 47.62,92.08 48.26,92.71 | 46.99,92.71 47.62,92.08 | 41.91,92.08 42.55,92.71 | 41.27,92.71 41.91,92.08 | 36.2,92.08 36.83,92.71 | 35.56,92.71 36.2,92.08 | 30.48,92.08 31.11,92.71 | 29.84,92.71 30.48,92.08 | 24.77,92.08 25.4,92.71 | 24.13,92.71 24.77,92.08 | 19.05,92.08 19.68,92.71 | 18.41,92.71 19.05,92.08
N$77
  Bottom 0.254: 9.53,90.17 10.16,90.17 | 9.53,90.17 8.26,90.17 | 9.53,94.61 11.43,94.61 | 9.53,94.61 9.53,92.71 9.53,90.17 | 9.53,90.17 9.53,88.9 | 9.53,94.61 9.53,95.89 | 9.53,94.61 8.26,94.61
N$78  (via drill 0.6)
  Top 0.813: LED1.RA 11.43,42.55 13.34,42.55 | 13.34,42.55 15.24,42.55 LED1.BA | 13.34,42.55 LED1.GA | v13.34,41.27 13.34,42.55
  Bottom 0.61: IC1.15 26.67,28.57 26.04,29.21 25.4,29.84 23.5,29.84 13.34,40.01 v13.34,41.27
  Bottom 0.813: 13.34,40.01 v13.34,41.27
N$79
  Bottom 0.254: 8.26,86.36 11.43,86.36
N$80
  Bottom 0.254: 9.53,80.64 9.53,87.63
N$81
  Bottom 0.254: 8.26,81.92 10.16,81.92
N$82
  Bottom 0.254: 80.01,86.36 83.19,86.36
N$83
  Bottom 0.254: 81.92,80.64 81.92,87.63
N$84
  Bottom 0.254: 83.19,81.92 81.28,81.92
N$85
  Bottom 0.254: 83.19,90.17 81.28,90.17
N$86
  Bottom 0.254: 81.92,88.9 81.92,91.44 81.92,95.89
N$87
  Bottom 0.254: 80.01,94.61 83.19,94.61
N$89  (via drill 0.6)
  Top 0.813: v80.01,73.03 v76.2,73.03 v70.48,73.03 v64.77,73.03 v59.05,73.03 v53.34,73.03 v47.62,73.03 v41.91,73.03 v36.2,73.03 v30.48,73.03 v24.77,73.03 v19.05,73.03 v13.34,73.03
  Bottom 0.813: v19.05,73.03 R5.2 | v30.48,73.03 R11.2 | v41.91,73.03 R17.2 | v53.34,73.03 R23.2 | v64.77,73.03 R29.2 | v76.2,73.03 R35.2 | R2.2 13.34,59.69 R2.2 | R2.2 13.34,60.33 | 13.34,60.33 13.34,60.96 | 13.34,60.96 v13.34,73.03 | 13.34,60.33 13.34,60.96 | R2.2 13.34,60.33 | 13.34,60.33 13.34,60.96 | R2.2 13.34,60.33 | v24.77,73.03 R8.2 | v36.2,73.03 R14.2 | v47.62,73.03 R20.2 | v59.05,73.03 R26.2 | v70.48,73.03 R32.2 | Q2.C 83.82,68.58 80.01,72.39 v80.01,73.03
N$90  (via drill 0.6)
  Top 0.61: v29.84,22.23 v34.29,22.23
  Bottom 0.61: SCL.1 15.24,27.3 22.23,20.32 23.5,20.32 26.67,20.32 28.57,22.23 | v34.29,22.23 33.66,22.23 v34.29,22.23 | v34.29,22.23 35.56,22.23 40.01,22.23 41.27,23.5 C3.+ 53.34,23.5 56.52,20.32 65.41,20.32 67.31,22.23 IC2.12 | v29.84,22.23 29.84,24.13 30.48,24.77 IC1.12
  Bottom 1.016: v34.29,22.23 35.56,22.23 | v29.84,22.23 28.57,22.23
N$92
  Bottom 0.61: D_OUT.1 90.17,23.5 76.2,23.5 73.03,26.67 72.92,26.77 IC2.9
N$93  (via drill 0.6)
  Top 0.813: v80.01,69.22 v74.3,69.22 v68.58,69.22 v62.87,69.22 v57.15,69.22 v51.44,69.22 v45.72,69.22 v40.01,69.22 v34.29,69.22 v28.57,69.22 v22.86,69.22 v17.14,69.22 v11.43,69.22
  Bottom 0.813: v11.43,69.22 R3.2 | v68.58,69.22 R33.2 | v22.86,69.22 R9.2 | v34.29,69.22 R15.2 | v45.72,69.22 R21.2 | v57.15,69.22 R27.2 | R6.2 v17.14,69.22 | v28.57,69.22 R12.2 | v40.01,69.22 R18.2 | v51.44,69.22 R24.2 | v62.87,69.22 R30.2 | v74.3,69.22 R36.2 | v80.01,69.22 80.01,64.14 80.01,62.87 82.55,60.33 Q1.C
N$94  (via drill 0.6 pad 0.25)
  Top 0.813: LED10.RA 62.87,42.55 64.77,42.55 | 64.77,42.55 66.67,42.55 LED10.BA | 64.77,42.55 LED10.GA | v64.77,41.27 64.77,42.55
  Bottom 0.61: IC2.1 62.23,37.47 64.77,40.01
  Bottom 0.813: 64.77,40.01 v64.77,41.27
N$95  (via drill 0.6)
  Top 0.813: LED11.RA 68.58,42.55 70.48,42.55 | 70.48,42.55 72.39,42.55 LED11.BA | 70.48,42.55 LED11.GA | v70.48,41.27 70.48,42.55
  Bottom 0.61: IC2.2 63.5,35.56 67.94,40.01 70.48,40.01
  Bottom 0.813: 70.48,40.01 v70.48,41.27
N$96  (via drill 0.6 pad 0.25)
  Top 0.813: v76.2,41.27 76.2,42.55 | 76.2,42.55 LED12.GA | LED12.RA 74.3,42.55 76.2,42.55 | 76.2,42.55 78.11,42.55 LED12.BA
  Bottom 0.61: 76.2,40.01 74.93,38.73 73.66,37.47 67.94,37.47 64.77,34.29 IC2.3
  Bottom 0.813: 76.2,40.01 v76.2,41.27

### Text on the board
Top: RGB VU | V 1.4 | robelix
Bottom: RGB | GND | IN | SCL | +5V | SCK | OUT